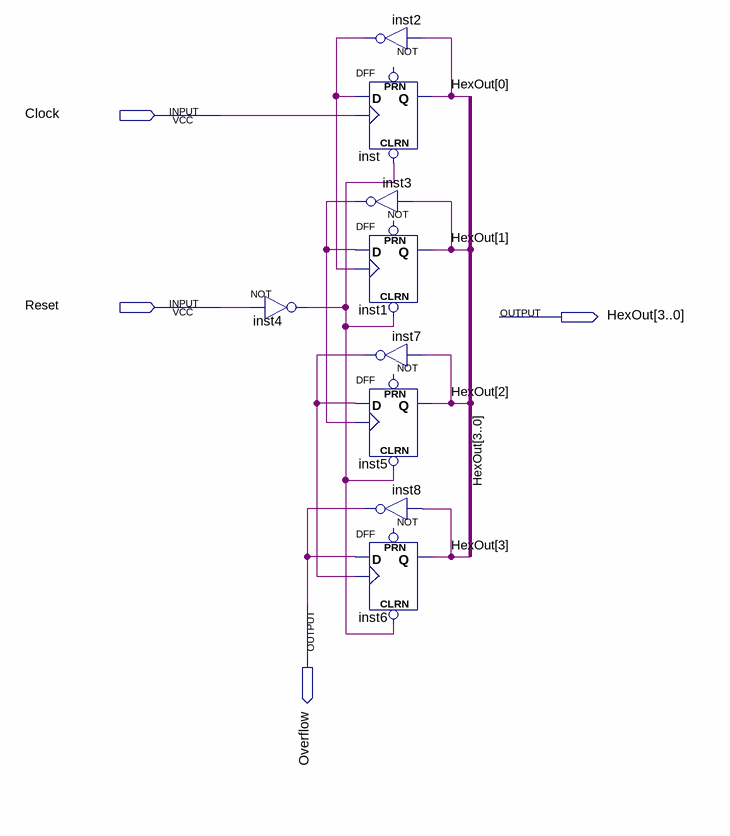
[diagram p0: schematic sheet]
// Quartus schematic HexCounter.bdf as structural Verilog: 9 symbols, 4 pins
module HexCounter (
  input  Clock,
  input  Reset,
  output [3:0] HexOut,
  output Overflow
);

  wire inst2_out, inst3_out, inst4_out, inst7_out;

  not inst4 (inst4_out, Reset);
  not inst2 (inst2_out, HexOut[0]);
  DFF inst (.CLRN(inst4_out), .CLK(Clock), .D(inst2_out), .Q(HexOut[0]));  // open: PRN
  not inst3 (inst3_out, HexOut[1]);
  DFF inst1 (.CLRN(inst4_out), .CLK(inst2_out), .D(inst3_out), .Q(HexOut[1]));  // open: PRN
  not inst7 (inst7_out, HexOut[2]);
  DFF inst5 (.CLRN(inst4_out), .CLK(inst3_out), .D(inst7_out), .Q(HexOut[2]));  // open: PRN
  not inst8 (Overflow, HexOut[3]);
  DFF inst6 (.CLRN(inst4_out), .CLK(inst7_out), .D(Overflow), .Q(HexOut[3]));  // open: PRN
endmodule
